# Altium schematic sheet USB_Connectors.SchDoc: Ixora
size A3; Organization: Toradex AG; Address1: Altsagenstrasse 5; Address2: Horw; Address3: 6048; Address4: Switzerland; DocumentNumber: 7; Revision: V1.1; SheetNumber: 7; SheetTotal: 19; PageSetup: Record=PageOptions|CenterHorizontal=True|CenterVertical=True|PrintScale=0.71|XCorrection=1.00|YCorrection=1.00|PrintKind=0|BorderSize=5000000|LeftOffset=0|BottomOffset=0|Orientation=2|PaperLength=1000|PaperWidth=1000|Scale=100|PaperSource=7|PrintQuality=-4|MediaType=1|DitherType=10|PaperKind=A4|PrintScaleMode=1
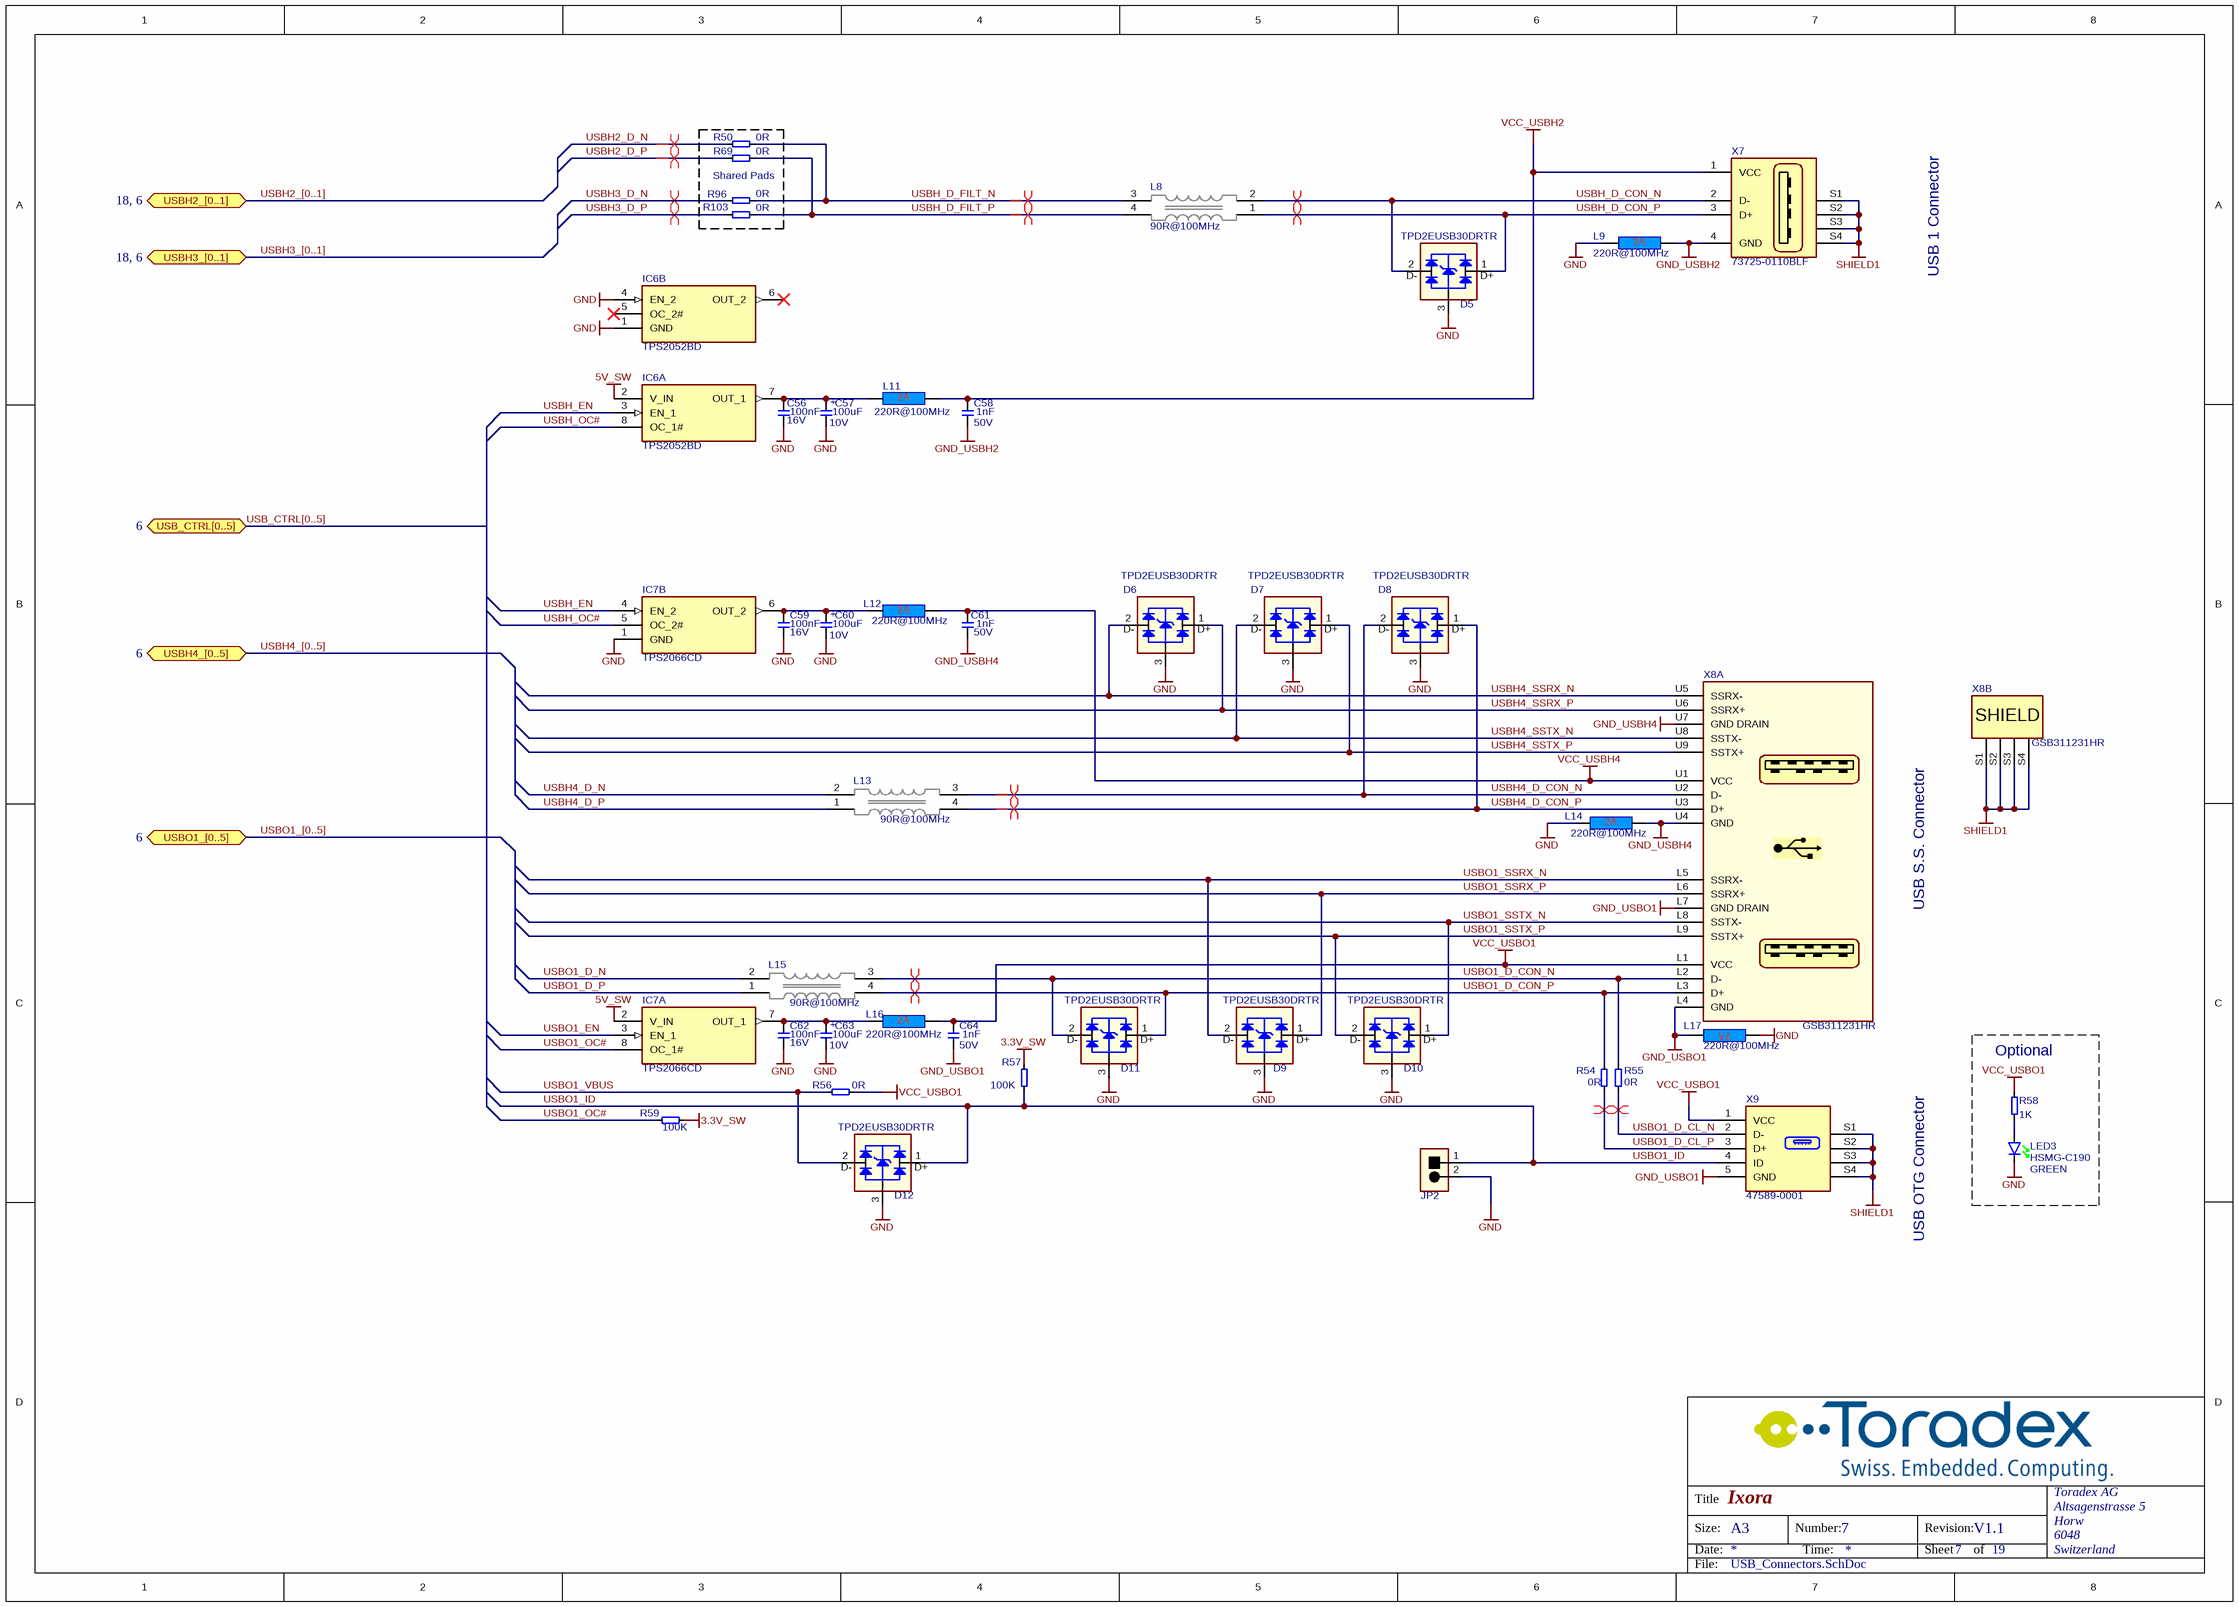
[diagram p0: USB_Connectors.SchDoc]

## Parts
C56  Rating: 16V  [CAPC1005X60N]  (hidden comment: 100nF)
C57  Rating: 10V  [CAPMP6032X280N]  (hidden comment: 100uF)
C58  Rating: 50V  [CAPC1005X60N]  (hidden comment: 1nF)
C59  Rating: 16V  [CAPC1005X60N]  (hidden comment: 100nF)
C60  Rating: 10V  [CAPMP6032X280N]  (hidden comment: 100uF)
C61  Rating: 50V  [CAPC1005X60N]  (hidden comment: 1nF)
C62  Rating: 16V  [CAPC1005X60N]  (hidden comment: 100nF)
C63  Rating: 10V  [CAPMP6032X280N]  (hidden comment: 100uF)
C64  Rating: 50V  [CAPC1005X60N]  (hidden comment: 1nF)
D5  TPD2EUSB30DRTR  [T_TI_TPD2EUSB30DRTR]
D6  TPD2EUSB30DRTR  [T_TI_TPD2EUSB30DRTR]
D7  TPD2EUSB30DRTR  [T_TI_TPD2EUSB30DRTR]
D8  TPD2EUSB30DRTR  [T_TI_TPD2EUSB30DRTR]
D9  TPD2EUSB30DRTR  [T_TI_TPD2EUSB30DRTR]
D10  TPD2EUSB30DRTR  [T_TI_TPD2EUSB30DRTR]
D11  TPD2EUSB30DRTR  [T_TI_TPD2EUSB30DRTR]
D12  TPD2EUSB30DRTR  [T_TI_TPD2EUSB30DRTR]
IC6  TPS2052BD  [SOIC127P600X173-8N]  (parts A,B of 2)
IC7  TPS2066CD  [SOIC127P600X173-8N]  (parts A,B of 2)
JP2  TSW-101-07-G-D  [T_Samtec_TSW-101-07-G-D]  (value not drawn)
L8  90R@100MHz  [T_Murata_DLW21SN900SQ2]
L9  220R@100MHz  [INDC1608X95N]
L11  220R@100MHz  [INDC1608X95N]
L12  220R@100MHz  [INDC1608X95N]
L13  90R@100MHz  [T_Murata_DLW21SN900SQ2]
L14  220R@100MHz  [INDC1608X95N]
L15  90R@100MHz  [T_Murata_DLW21SN900SQ2]
L16  220R@100MHz  [INDC1608X95N]
L17  220R@100MHz  [INDC1608X95N]
LED3  Manufacturer Part No.: HSMG-C190  Color: GREEN  [LEDC1608X80N_G]  (hidden comment: LED)
R50  0R  [T_RESC0603X30N]
R54  0R  [RESC1005X40N]
R55  0R  [RESC1005X40N]
R56  0R  [RESC1005X40N]
R57  100K  [RESC1005X40N]
R58  1K  [RESC1005X40N]
R59  100K  [RESC1005X40N]
R69  0R  [T_RESC0603X30N]
R96  0R  [T_RESC0603X30N]
R103  0R  [T_RESC0603X30N]
X7  Manufacturer Part No.: 73725-0110BLF  [T_FCI_73725-0110BLF]  (hidden comment: CON-Fci-73725-0110BLF)
X8  GSB311231HR  [T_AMPHENOL_ GSB311231HR]  (parts A,B of 2)
X9  Manufacturer Part No.: 47589-0001  [T_Molex_47589-0001]  (hidden comment: CON-Molex-47589-0001-5-0.65)

## Blocks framed on the sheet
Shared Pads: R50 R69 R96 R103
Optional: LED3 R58

## Ports
USB_CTRL[0..5] (bidir, see 6), USBH2_[0..1] (bidir, see 18, 6), USBH3_[0..1] (bidir, see 18, 6), USBH4_[0..5] (bidir, see 6), USBO1_[0..5] (bidir, see 6)

## Nets
3.3V_SW: R57.1 R59.2
5V_SW: IC6.2(V_IN) IC7.2(V_IN)
GND: C56.1 C57.2 C59.1 C60.2 C62.1 C63.2 D5.3 D6.3 D7.3 D8.3 D9.3 D10.3 D11.3 D12.3 IC6.1(GND) IC6.4(EN_2) IC7.1(GND) JP2.2 L9.1 L14.1 L17.1 LED3.1(K)
GND_USBH2: C58.1 L9.2 X7.4(GND)
GND_USBH4: C61.1 L14.2 X8.U4(GND) X8.U7(GND_DRAIN)
GND_USBO1: C64.1 L17.2 X8.L4(GND) X8.L7(GND_DRAIN) X9.5(GND)
SHIELD1: X7.S1 X7.S2 X7.S3 X7.S4 X8.S1(SHIELD) X8.S2(SHIELD) X8.S3(SHIELD) X8.S4(SHIELD) X9.S1 X9.S2 X9.S3 X9.S4
VCC_USBH2: C58.2 L11.2 X7.1(VCC)
VCC_USBH4: C61.2 L12.2 X8.U1(VCC)
VCC_USBO1: C64.2 L16.2 R56.2 R58.1 X8.L1(VCC) X9.1(VCC)
USBH2_D_N: R50.1
USBH2_D_P: R69.1
USBH3_D_N: R96.1
USBH3_D_P: R103.1
USBH4_D_CON_N: D8.2(D-) L13.3 X8.U2(D-)
USBH4_D_CON_P: D8.1(D+) L13.4 X8.U3(D+)
USBH4_D_N: L13.2
USBH4_D_P: L13.1
USBH4_SSRX_N: D6.2(D-) X8.U5(SSRX-)
USBH4_SSRX_P: D6.1(D+) X8.U6(SSRX+)
USBH4_SSTX_N: D7.2(D-) X8.U8(SSTX-)
USBH4_SSTX_P: D7.1(D+) X8.U9(SSTX+)
USBH_D_CON_N: D5.2(D-) L8.2 X7.2(D-)
USBH_D_CON_P: D5.1(D+) L8.1 X7.3(D+)
USBH_D_FILT_N: L8.3 R50.2 R96.2
USBH_D_FILT_P: L8.4 R69.2 R103.2
USBH_EN: IC6.3(EN_1) IC7.4(EN_2)
USBH_OC#: IC6.8(OC_1#) IC7.5(OC_2#)
USBO1_D_CL_N: R55.1 X9.2(D-)
USBO1_D_CL_P: R54.1 X9.3(D+)
USBO1_D_CON_N: D11.2(D-) L15.3 R55.2 X8.L2(D-)
USBO1_D_CON_P: D11.1(D+) L15.4 R54.2 X8.L3(D+)
USBO1_D_N: L15.2
USBO1_D_P: L15.1
USBO1_EN: IC7.3(EN_1)
USBO1_ID: D12.1(D+) JP2.1 R57.2 X9.4(ID)
USBO1_OC#: IC7.8(OC_1#) R59.1
USBO1_SSRX_N: D9.2(D-) X8.L5(SSRX-)
USBO1_SSRX_P: D9.1(D+) X8.L6(SSRX+)
USBO1_SSTX_N: D10.1(D+) X8.L8(SSTX-)
USBO1_SSTX_P: D10.2(D-) X8.L9(SSTX+)
USBO1_VBUS: D12.2(D-) R56.1
NetC56_2: C56.2 C57.1 IC6.7(OUT_1) L11.1
NetC59_2: C59.2 C60.1 IC7.6(OUT_2) L12.1
NetC62_2: C62.2 C63.1 IC7.7(OUT_1) L16.1
NetLED3_2: LED3.2(A) R58.2

Not connected (* = marked no-connect by the designer): IC6 5(OC_2#)* 6(OUT_2)*

## Buses and harness runs
bus USB_CTRL[0..5] = port USB_CTRL[0..5]
bus USBH2_[0..1] = port USBH2_[0..1]
bus USBH3_[0..1] = port USBH3_[0..1]
bus USBH4_[0..5] = port USBH4_[0..5]
bus USBO1_[0..5] = port USBO1_[0..5]

## Layout directives
differential pair: USBH2_D_N, USBH2_D_P, USBH3_D_N, USBH3_D_P, USBH4_D_CON_N, USBH4_D_CON_P, USBH_D_CON_N, USBH_D_CON_P, USBH_D_FILT_N, USBH_D_FILT_P, USBO1_D_CL_N, USBO1_D_CL_P, USBO1_D_CON_N, USBO1_D_CON_P

## Notes on the sheet
- USB 1 Connector
- USB S.S. Connector
- USB OTG Connector
- Title
- Size:
- Date:
- A3
- Number:
- Time:
- Revision:
- Sheet
- of
- File:
- (in symbol C-TA-100uF-10V-10%-6032) +

## Library data of the parts
C56 C59 C62 = C-X7R-100nF-16V-10%-0402: Capacitor Ceramic X7R 100nF 16V 10% 0402; Tolerance: 10%; Type: X7R; Value: 100nF
C57 C60 C63 = C-TA-100uF-10V-10%-6032: Capacitor TA 100uF 10V 10% 6032; Tolerance: 10%; Type: TA; Value: 100uF
C58 C61 C64 = C-X7R-1nF-50V-10%-0402: Capacitor Ceramic X7R 1nF 50V 10% 0402; Tolerance: 10%; Type: X7R; Value: 1nF
D5-D12 = D-TI-TPD2EUSB30DRTR: 2 Channel Protection for Super Speed USB3.0; Manufacturer Name: TI; Manufacturer Part No.: TPD2EUSB30DRTR
IC6 = IC-TI-TPS2052BD: Dual High Side Switch With OC_DET 500mA/CH; Manufacturer Name: Texas Instruments; Manufacturer Part No.: TPS2052BD
IC7 = IC-TI-TPS2066CD: 1A Dual High Side Switch (Current Limiting (Fixed), Over Temperature, Reverse Current, UVLO); Manufacturer Name: Texas Instruments; Manufacturer Part No.: TPS2066CD
JP2 = CON-Samtec-TSW-101-07-G-D: Header male, 1x2 Pins, 2.54 mm pitch; Manufacturer Name: Samtec; Pitch: 2.54 mm; No. of ways: 1x2; Manufacturer Part no.: TSW-101-07-G-D
L8 L13 L15 = L-Murata-DLW21SN900SQ2-90R@100MHz-330mA-25%: Common Mode Choke High Speed 90R 330mA; Manufacturer Name: Murata; Tolerance: 25%; Rating: 330mA; Manufacturer Part No.: DLW21SN900SQ2; Value: 90R@100MHz
L9 L11 L12 L14 L16 L17 = L-220R@100MHz-2A-25%-0603: 220R@100MHz 2A EMI FILTER; Tolerance: 25%; Rating: 2A; Value: 220R@100MHz
LED3 = LED-Avago-HSMG-C190: Surface mount LED green 20mA; Manufacturer Name: Avago
R50 R69 R96 R103 = R-0R-63mW-1%-0603: Resistor 0 ohm 63mW 1% 0603; Rating: 63mW; Tolerance: 1%; Value: 0R
R54-R56 = R-0R-63mW-1%-0402: Resistor 0 ohm 63mW 1% 0402; Rating: 63mW; Tolerance: 1%; Value: 0R
R57 R59 = R-100KR-63mW-5%-0402: Resistor 100 Kohm 63mW 5% 0402; Value: 100KR; Rating: 63mW; Tolerance: 5%
R58 = R-1KR-63mW-5%-0402: Resistor 1 Kohm 63mW 5% 0402; Rating: 63mW; Tolerance: 5%; Value: 1K
X7 = CON-Fci-73725-0110BLF: USB Type A Connector; Manufacturer Name: FCI; No. of ways: 4
X8 = CON-Amphenol-GSB311231HR: USB 3.0 double row, Type A; No. of ways: 18; Manufacturer Name: Amphenol; Manufacturer Part No.: GSB311231HR
X9 = CON-Molex-47589-0001-5-0.65: Micro USB OTG Connector; Manufacturer Name: Molex; No. of ways: 5